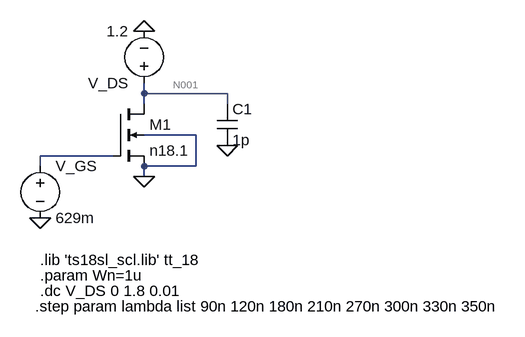
[diagram p0: schematic q3_copy.asc]
q3_copy.asc, the LTspice schematic file:
Version 4.1
SHEET 1 924 680
WIRE 304 112 304 96
WIRE 432 112 304 112
WIRE 304 128 304 112
WIRE 432 128 432 112
WIRE 384 176 304 176
WIRE 256 208 144 208
WIRE 144 224 144 208
WIRE 384 224 384 176
WIRE 384 224 304 224
WIRE 304 240 304 224
FLAG 304 16 0
FLAG 304 240 0
FLAG 144 304 0
FLAG 432 192 0
SYMBOL voltage 304 112 R180
WINDOW 123 0 0 Left 0
WINDOW 39 0 0 Left 0
SYMATTR InstName V_DS
SYMATTR Value 1.2
SYMBOL nmos4 256 128 R0
SYMATTR InstName M1
SYMATTR Value n18.1
SYMATTR Value2 l={2*lambda} w={Wn} ad={5*lambda*Wn} as={5*lambda*Wn} pd={2*Wn + 10*lambda} ps={2*Wn + 10*lambda}
SYMBOL voltage 144 208 R0
WINDOW 123 24 124 Left 2
WINDOW 39 0 0 Left 0
SYMATTR InstName V_GS
SYMATTR Value 629m
SYMBOL cap 416 128 R0
SYMATTR InstName C1
SYMATTR Value 1p
TEXT 144 392 Left 2 !.param Wn=1u
TEXT 144 368 Left 2 !.lib 'ts18sl_scl.lib' tt_18
TEXT 144 416 Left 2 !.dc V_DS 0 1.8 0.01
TEXT 136 440 Left 2 !.step param lambda list 90n 120n 180n 210n 270n 300n 330n 350n

The netlist it stands for:
* q3_copy.asc
V_DS N001 0 1.2
M1 N001 N002 0 0 n18.1 l={2*lambda} w={Wn} ad={5*lambda*Wn} as={5*lambda*Wn} pd={2*Wn + 10*lambda} ps={2*Wn + 10*lambda}
V_GS N002 0 629m
C1 N001 0 1p
.model NMOS NMOS
.model PMOS PMOS
.lib standard.mos
.param Wn=1u
.lib 'ts18sl_scl.lib' tt_18
.dc V_DS 0 1.8 0.01
.step param lambda list 90n 120n 180n 210n 270n 300n 330n 350n
.backanno
.end

* Results of the author's LTspice run, read from the files saved beside the schematic
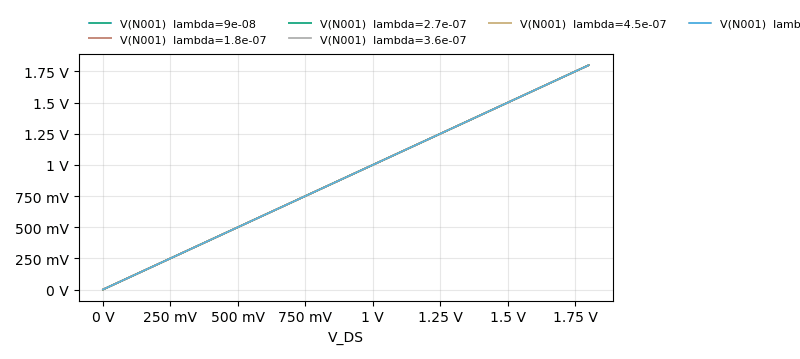
[diagram p1: DC transfer characteristic of q3_copy.asc, plotted from the saved traces]
* DC transfer characteristic, 6 runs:
*   V(N001) [lambda=9e-08]: 0 V at V_DS=0 V, 1.8 V at V_DS=1.8 V, min 0 V, max 1.8 V
*   V(N001) [lambda=1.8e-07]: 0 V at V_DS=0 V, 1.8 V at V_DS=1.8 V, min 0 V, max 1.8 V
*   V(N001) [lambda=2.7e-07]: 0 V at V_DS=0 V, 1.8 V at V_DS=1.8 V, min 0 V, max 1.8 V
*   V(N001) [lambda=3.6e-07]: 0 V at V_DS=0 V, 1.8 V at V_DS=1.8 V, min 0 V, max 1.8 V
*   V(N001) [lambda=4.5e-07]: 0 V at V_DS=0 V, 1.8 V at V_DS=1.8 V, min 0 V, max 1.8 V
*   V(N001) [lambda=5.4e-07]: 0 V at V_DS=0 V, 1.8 V at V_DS=1.8 V, min 0 V, max 1.8 V